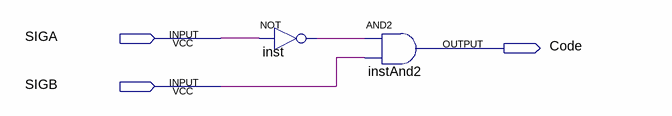
[diagram p0: schematic sheet]
// Quartus schematic sigEncoder2.bdf as structural Verilog: 2 symbols, 3 pins
module sigEncoder2 (
  input  SIGA,
  input  SIGB,
  output Code
);

  wire inst_out;

  not inst (inst_out, SIGA);
  and instAnd2 (Code, inst_out, SIGB);
endmodule
